# Altium project robocart_steerbrake_node.PrjPcb
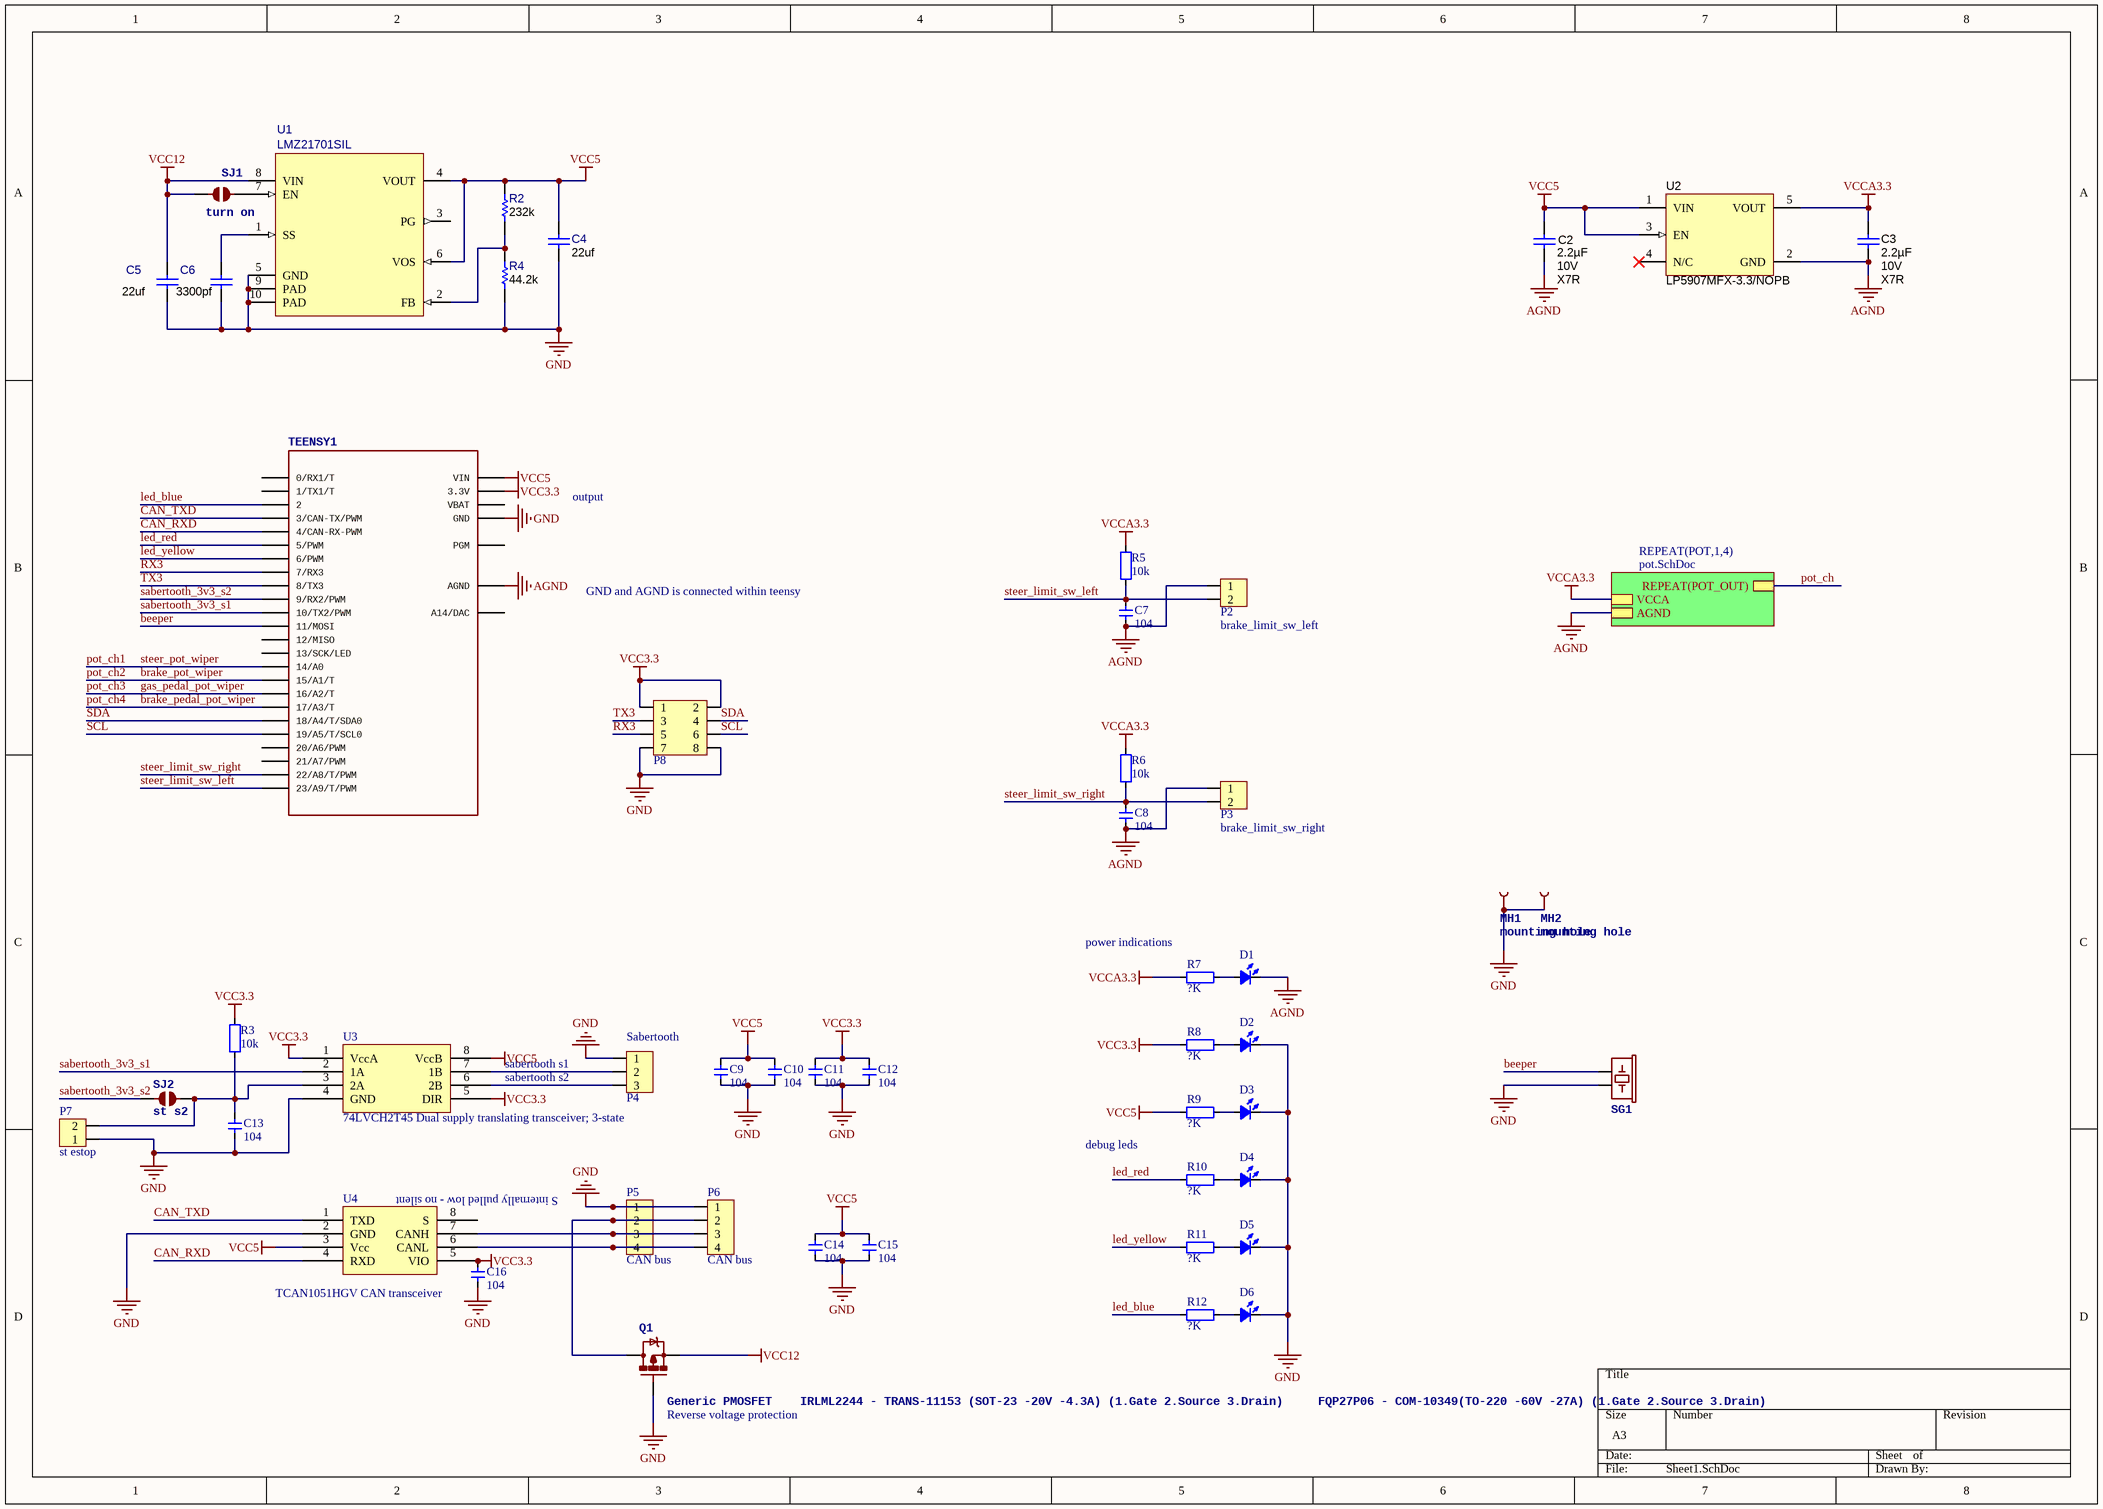
[diagram p0: Sheet1.SchDoc]
2 sheets, 62 parts. Net scope: hierarchical (ports join the sheet entries above them; power ports are global).
Board file: board.PcbDoc
Sheets:
  Sheet1.SchDoc
    POT1 = pot.SchDoc
    POT2 = pot.SchDoc
    POT3 = pot.SchDoc
    POT4 = pot.SchDoc

## Sheet Sheet1.SchDoc
size A3

### Parts
C2  ValueDisplayed: 2.2µF  Value2: 10V  TempCo: X7R  [CAP_0603]  (hidden comment: GRM188R71A225KE15D)
C3  ValueDisplayed: 2.2µF  Value2: 10V  TempCo: X7R  [CAP_0603]  (hidden comment: GRM188R71A225KE15D)
C4  ValueDisplayed: 22uf  [CAP_0805]  (hidden comment: GRM188R71A225KE15D)
C5  ValueDisplayed: 22uf  [CAP_0805]  (hidden comment: GRM155R71E822KA01D)
C6  ValueDisplayed: 3300pf  [CAP_0603]  (hidden comment: GRM155R71E822KA01D)
C7  value 104  [CAP_0603]  (hidden comment: Cap_0603)
C8  value 104  [CAP_0603]  (hidden comment: Cap_0603)
C9  value 104  [CAP_0603]  (hidden comment: Cap_0603)
C10  value 104  [CAP_0603]  (hidden comment: Cap_0603)
C11  value 104  [CAP_0603]  (hidden comment: Cap_0603)
C12  value 104  [CAP_0603]  (hidden comment: Cap_0603)
C13  value 104  [CAP_0603]  (hidden comment: Cap_0603)
C14  value 104  [CAP_0603]  (hidden comment: Cap_0603)
C15  value 104  [CAP_0603]  (hidden comment: Cap_0603)
C16  value 104  [CAP_0603]  (hidden comment: Cap_0603)
D1  LED_0603  [LED_0603_RED]  (value not drawn)
D2  LED_0603  [LED_0603_RED]  (value not drawn)
D3  LED_0603  [LED_0603_RED]  (value not drawn)
D4  LED_0603  [LED_0603_RED]  (value not drawn)
D5  LED_0603  [LED_0603_RED]  (value not drawn)
D6  LED_0603  [LED_0603_RED]  (value not drawn)
MH1  mounting hole  [M3 hole]
MH2  mounting hole  [M3 hole]
P2  brake_limit_sw_left  [COMBICON PTSA 2]
P3  brake_limit_sw_right  [COMBICON PTSA 2]
P4  Sabertooth  [COMBICON PTSA 3]
P5  CAN bus  [COMBICON PTSA 4]
P6  CAN bus  [COMBICON PTSA 4]
P7  st estop  [COMBICON PTSA 2]
P8  HDR2x4_2.54  [HDR2X4_2.54_90]  (value not drawn)
Q1  Generic PMOSFET    IRLML2244 - TRANS-11153 (SOT-23 -20V -4.3A) (1.Gate 2.Source 3.Drain)     FQP27P06 - COM-10349(TO-220 -60V -27A) (1.Gate 2.Source 3.Drain)  [SOT23-3]
R2  value 232k  [RES_0603]  (hidden comment: CRCW040235K7FKED)
R3  value 10k  [RES_0603]  (hidden comment: Res_0603)
R4  value 44.2k  [RES_0603]  (hidden comment: CRCW04026K81FKED)
R5  value 10k  [RES_0603]  (hidden comment: Res_0603)
R6  value 10k  [RES_0603]  (hidden comment: Res_0603)
R7  value ?K  [RES_0603]  (hidden comment: Res_0603)
R8  value ?K  [RES_0603]  (hidden comment: Res_0603)
R9  value ?K  [RES_0603]  (hidden comment: Res_0603)
R10  value ?K  [RES_0603]  (hidden comment: Res_0603)
R11  value ?K  [RES_0603]  (hidden comment: Res_0603)
R12  value ?K  [RES_0603]  (hidden comment: Res_0603)
SG1  Buzzer 12mmSpark Fun Electronics SKU : Comp-Buzzer  [Buzzer_5x5]  (value not drawn)
SJ1  turn on  [HDR1X2_2.54_180]
SJ2  st s2  [PAD-JUMPER-2-NO_YES_SILK]
TEENSY1  Footprint for Teensy 3.1 board using all pin connections on the outer perimeter  [TEENSY_3.1_BASIC_FIXED]  (value not drawn)
U1  LMZ21701SIL  [LMZ21701SIL]
U2  LP5907MFX-3.3/NOPB  [DBV0005A_N]
U3  74LVCH2T45 Dual supply translating transceiver; 3-state  [SOP65P490X110-8N]
U4  TCAN1051HGV CAN transceiver  [SOIC_E200_8]

### Sub-sheets
REPEAT(POT,1,4) = pot.SchDoc: REPEAT(POT_OUT), AGND, VCCA

### Nets
AGND: C2.1 C3.1 C7.1 C8.1 D1.2(K) P2.1 P3.1 TEENSY1.AGND U2.2(GND) ; sheet REPEAT(POT,1,4)/AGND
GND: C4.2 C5.2 C6.2 C9.1 C10.1 C11.1 C12.1 C13.1 C14.1 C15.1 C16.1 D2.2(K) D3.2(K) D4.2(K) D5.2(K) D6.2(K) MH1.P$1 MH2.P$1 P4.1 P5.1 P6.1 P7.1 P8.7 P8.8 Q1.1(G) R4.1 SG1.- TEENSY1.GND_GND1(GND) U1.5(GND) U1.9(PAD) U1.10(PAD) U3.4(GND) U4.2(GND)
VCC3.3: C11.2 C12.2 C16.2 P8.1 P8.2 R3.2 R8.1 TEENSY1.3.3V_3.3V1(3.3V) U3.1(VccA) U3.5(DIR) U4.5(VIO)
VCC5: C2.2 C4.1 C9.2 C10.2 C14.2 C15.2 R2.2 R9.1 TEENSY1.VIN U1.4(VOUT) U1.6(VOS) U2.1(VIN) U2.3(EN) U3.8(VccB) U4.3(Vcc)
VCC12: C5.1 Q1.2(S) SJ1.1 U1.8(VIN)
VCCA3.3: C3.2 R5.2 R6.2 R7.1 U2.5(VOUT) ; sheet REPEAT(POT,1,4)/VCCA
beeper: SG1.+ TEENSY1.11(11/MOSI)
brake_pedal_pot_wiper: TEENSY1.17/A3(17/A3/T)  [also labelled pot_ch4]
brake_pot_wiper: TEENSY1.15/A1(15/A1/T)  [also labelled pot_ch2]
CAN_RXD: TEENSY1.4(4/CAN-RX-PWM) U4.4(RXD)
CAN_TXD: TEENSY1.3(3/CAN-TX/PWM) U4.1(TXD)
gas_pedal_pot_wiper: TEENSY1.16/A2(16/A2/T)  [also labelled pot_ch3]
led_blue: R12.1 TEENSY1.2
led_red: R10.1 TEENSY1.5(5/PWM)
led_yellow: R11.1 TEENSY1.6(6/PWM)
pot_ch: sheet REPEAT(POT,1,4)/REPEAT(POT_OUT)
pot_ch1: TEENSY1.14/A0  [also labelled steer_pot_wiper]
RX3: P8.5 TEENSY1.7(7/RX3)
sabertooth_3v3_s1: TEENSY1.10(10/TX2/PWM) U3.2(1A)
sabertooth_3v3_s2: SJ2.1 TEENSY1.9(9/RX2/PWM)
SCL: P8.6 TEENSY1.19/A5(19/A5/T/SCL0)
SDA: P8.4 TEENSY1.18/A4(18/A4/T/SDA0)
steer_limit_sw_left: C7.2 P2.2 R5.1 TEENSY1.23/A9(23/A9/T/PWM)
steer_limit_sw_right: C8.2 P3.2 R6.1 TEENSY1.22/A8(22/A8/T/PWM)
TX3: P8.3 TEENSY1.8(8/TX3)
NetC6_1: C6.1 U1.1(SS)
NetC13_2: C13.2 P7.2 R3.1 SJ2.2 U3.3(2A)
NetD1_1: D1.1(A) R7.2
NetD2_1: D2.1(A) R8.2
NetD3_1: D3.1(A) R9.2
NetD4_1: D4.1(A) R10.2
NetD5_1: D5.1(A) R11.2
NetD6_1: D6.1(A) R12.2
NetP4_2: P4.2 U3.7(1B)
NetP4_3: P4.3 U3.6(2B)
NetP5_2: P5.2 P6.2 Q1.3(D)
NetP5_3: P5.3 P6.3 U4.7(CANH)
NetP5_4: P5.4 P6.4 U4.6(CANL)
NetR2_1: R2.1 R4.2 U1.2(FB)
NetSJ1_2: SJ1.2 U1.7(EN)

Not connected (* = marked no-connect by the designer): TEENSY1 0(0/RX1/T) 1(1/TX1/T) 12(12/MISO) 13(13/SCK/LED) 20/A6(20/A6/PWM) 21/A7(21/A7/PWM) A14(A14/DAC) PGM VBAT; U1 3(PG); U2 4(N/C)*; U4 8(S)

### Notes on the sheet
- output
- GND and AGND is connected within teensy
- (near R7) power indications
- sabertooth s1
- sabertooth s2
- (near U4) S internally pulled low - no silent
- debug leds
- (near Q1) Reverse voltage protection

### Library data of the parts
C2 C4 = GRM188R71A225KE15D: CAP, CERM, 2.2uF, 10V, +/-10%, X7R, 0603; Manufacturer: MuRata; Polarized: N; CompType: Capacitor; U/M: EA; Cap_F: 0.0000022; Tolerance_%: 10; ESR_Ohm: 0.009; Value1: 0.009 ohm; TaMin_C: -55; TaMax_C: 125; Cap_Case: 0603; SymbolVersion: 2008-07-09; Value: 2.2uF; PartNumber: GRM188R71A225KE15D; PackageReference: 0603; RoHS: Y; VDC_V: 10; MountType: SMT; Technology: Ceramic; Published: 2008-06-19; Publisher: Texas Instruments; ComponentLink1Description: Datasheet link; ComponentLink1URL: http://search.murata.co.jp/Ceramy/PnsearchViewAction.do?HnOFG=ON&HnNFG=ON&SEL_CNT=50&sLang=en&sKey=GRM188R71A225KE15D&x=9&y=9&search=startwith; Supplier 1: Digi-Key; Supplier Part Number 1: 490-4520-1-ND; Supplier 2: Mouser; Supplier Part Number 2: 81-GRM188R71A225KE15; Supplier 3: Farnell; Supplier Part Number 3: 1797012
  C2: LatestRevisionDate: 2014-07-08
  C4: Value2: 10V; TempCo: X7R; LatestRevisionDate: 2014-06-17
C3 = GRM188R71A225KE15D: CAP, CERM, 2.2 µF, 10 V, +/- 10%, X7R, 0603; Manufacturer: MuRata; Polarized: N; CompType: Capacitor; Value: 2.2uF; U/M: EA; Cap_F: 0.0000022; Tolerance_%: 10; ESR_ohm: 0.009; Value1: 0.009 ohm; TaMin_C: -55; TaMax_C: 125; Cap_Case: 0603; SymbolVersion: 2008-07-09; PartNumber: GRM188R71A225KE15D; PackageReference: 0603; RoHS: Y; VDC_V: 10; MountType: SMT; Technology: Ceramic; Published: 2008-06-19; Publisher: Texas Instruments; LatestRevisionDate: 2014-07-21; ComponentLink1Description: Datasheet link; ComponentLink1URL: http://search.murata.co.jp/Ceramy/PnsearchViewAction.do?HnOFG=ON&HnNFG=ON&SEL_CNT=50&sLang=en&sKey=GRM188R71A225KE15D&x=9&y=9&search=startwith; Supplier 1: Digi-Key; Supplier Part Number 1: 490-4520-1-ND; Supplier 2: Mouser; Supplier Part Number 2: 81-GRM188R71A225KE15; Supplier 3: Farnell; Supplier Part Number 3: 1797012
C5 C6 = GRM155R71E822KA01D: CAP, CERM, 8200pF, 25V, +/-10%, X7R, 0402; Manufacturer: MuRata; Polarized: N; CompType: Capacitor; U/M: EA; Cap_F: 0.0000000082; Tolerance_%: 10; Value1: Unknown; VDC_V: 25; TaMin_C: -55; TaMax_C: 125; Cap_Case: 0402; SymbolVersion: 2008-07-09; Value: 8200pF; PartNumber: GRM155R71E822KA01D; PackageReference: 0402; RoHS: Y; Value2: 25V; MountType: SMT; Technology: Ceramic; TempCo: X7R; Published: 2008-06-19; Publisher: Texas Instruments; LatestRevisionDate: 2014-07-07; ComponentLink1Description: Datasheet link; ComponentLink1URL: http://search.murata.co.jp/Ceramy/PnsearchViewAction.do?HnOFG=ON&HnNFG=ON&SEL_CNT=50&sLang=en&sKey=GRM155R71E822KA01D&x=9&y=9&search=startwith; Supplier 1: Digi-Key; Supplier Part Number 1: 490-1311-1-ND; Supplier 2: Mouser; Supplier Part Number 2: 81-GRM155R71E822KA1D
C7-C16 = Cap_0603: Capacitor
D1-D6 = LED_0603: LED
MH1 MH2 = TEST-POINT2: pin to pad: P$1>1
P2 P3 P7 = HDR1x2_2.54: Header
P4 = HDR1x3_2.54: Header
P5 P6 = HDR1x4_2.54: Header
P8 = HDR2x4_2.54: Header
Q1 = MOSFET-PCHANNEL: PROD_ID: TRANS-08285
R2 = CRCW040235K7FKED: RES, 35.7k ohm, 1%, 0.063W, 0402; Manufacturer: Vishay-Dale; CompType: Resistor; Res_ohm: 35700; Value_Code: 35k7; Tolerance_%: 1; Power_W: 0.063; VDC_V: 50; TempCo: 100 ppm/C; EIA_Code: E96; U/M: EA; SymbolVersion: 2009-05-29; PartNumber: CRCW040235K7FKED; PackageReference: 0402; RoHS: Y; Value1: 1%; Value2: 0.063W; MountType: SMT; Technology: Thick Film; Published: 2008-06-26; Publisher: Texas Instruments; LatestRevisionDate: 2014-06-26; ComponentLink1Description: Datasheet link; ComponentLink1URL: http://www.vishay.com/docs/20035/dcrcwe3.pdf; Supplier 1: Digi-Key; Supplier Part Number 1: 541-35.7KLCT-ND; Supplier 2: Mouser; Supplier Part Number 2: 71-CRCW0402-35.7K-E3; Supplier 3: Farnell; Supplier Part Number 3: 1151195
R3 R5-R12 = Res_0603: Resistor
R4 = CRCW04026K81FKED: RES, 6.81k ohm, 1%, 0.063W, 0402; Manufacturer: Vishay-Dale; CompType: Resistor; Res_ohm: 6810; Value_Code: 6k81; Tolerance_%: 1; Power_W: 0.063; VDC_V: 50; TempCo: 100 ppm/C; EIA_Code: E96; U/M: EA; SymbolVersion: 2009-05-29; PartNumber: CRCW04026K81FKED; PackageReference: 0402; RoHS: Y; Value1: 1%; Value2: 0.063W; MountType: SMT; Technology: Thick Film; Published: 2008-06-26; Publisher: Texas Instruments; LatestRevisionDate: 2014-06-26; ComponentLink1Description: Datasheet link; ComponentLink1URL: http://www.vishay.com/docs/20035/dcrcwe3.pdf; Supplier 1: Digi-Key; Supplier Part Number 1: 541-6.81KLCT-ND; Supplier 2: Mouser; Supplier Part Number 2: 71-CRCW0402-6.81K-E3; Supplier 3: Farnell; Supplier Part Number 3: 1652819
SG1 = BUZZERPTH: pin to pad: +>P ->N
SJ1 SJ2 = JUMPER-PAD-2-NOROUND
TEENSY1 = TEENSY_3.1_BASIC: pin to pad: 3.3V 3.3V1>3.3V GND GND1>GND
U1 = LMZ21701SIL: 1A SIMPLE SWITCHER Nano Module with 17V Maximum Input Voltage, SIL0008E; Alternate Manufacturer: None; Manufacturer: Texas Instruments; SymbolCreator: a0411947; CompType: IC; U/M: EA; SymbolVersion: 2013-08-23; PartNumber: LMZ21701SIL; PackageReference: SIL0008E; MountType: SMT; ComponentLink1Description: Datasheet Link; ComponentLink1URL: https://sps06.itg.ti.com/sites/KMS/crossdivteams/altium/docs/ComponentDatasheets/LMZ21701_DS_2013_07_10.pdf; RoHS: Y; Publisher: Texas Instruments; LatestRevisionDate: 2014-08-23
U2 = LP5907MFX-3.3/NOPB: ULTRA LOW-NOISE, 250-mA LINEAR REGULATOR FOR RF AND ANALOG CIRCUITS REQUIRES NO BYPASS CAPACITOR, DBV0005A; Manufacturer: Texas Instruments; Alternate Manufacturer: None; CompType: IC; SymbolCreator: a0799628; U/M: EA; PackageReference: DBV0005A; Publisher: Texas Instruments; PartNumber: LP5907MFX-3.3/NOPB; RoHS: Y; ComponentLink1Description: Datasheet Link; ComponentLink1URL: http://www.ti.com/lit/ds/symlink/lp5907.pdf; SymbolVersion: 2014-03-21; MountType: SMT; LatestRevisionDate: 2014-07-28
U3 = 74LVCH2T45
U4 = TCAN1051HGV

## Sheet pot.SchDoc
size A
Used 4 times, as channels POT1, POT2, POT3, POT4. Parts and nets are listed once, with the designators drawn on the sheet.
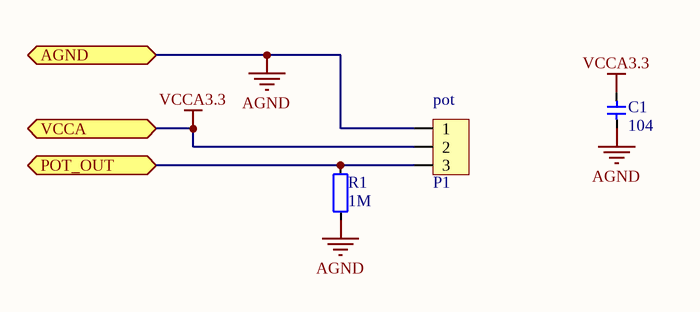
[diagram p1: pot.SchDoc]

### Parts
C1  value 104  [CAP_0603]  (hidden comment: Cap_0603)
P1  pot  [COMBICON PTSA 3]
R1  value 1M  [RES_0603]  (hidden comment: Res_0603)

### Ports
AGND, POT_OUT, VCCA

### Nets
AGND: C1.1 P1.1 R1.1 ; port AGND
VCCA3.3: C1.2 P1.2 ; port VCCA
POT_OUT: P1.3 R1.2 ; port POT_OUT

### Channels
POT1: designators end in _POT1; ports AGND=AGND POT_OUT=pot_ch1 VCCA=VCCA3.3
POT2: designators end in _POT2; ports AGND=AGND POT_OUT=brake_pot_wiper VCCA=VCCA3.3
POT3: designators end in _POT3; ports AGND=AGND POT_OUT=gas_pedal_pot_wiper VCCA=VCCA3.3
POT4: designators end in _POT4; ports AGND=AGND POT_OUT=brake_pedal_pot_wiper VCCA=VCCA3.3

### Library data of the parts
C1 = Cap_0603: Capacitor
P1 = HDR1x3_2.54: Header
R1 = Res_0603: Resistor

## Nets that join several sheets
AGND: Sheet1 (9 pins), POT1 (C1_POT1.1 P1_POT1.1 R1_POT1.1), POT2 (C1_POT2.1 P1_POT2.1 R1_POT2.1), POT3 (C1_POT3.1 P1_POT3.1 R1_POT3.1), POT4 (C1_POT4.1 P1_POT4.1 R1_POT4.1)
VCCA3.3: Sheet1 (5 pins), POT1 (C1_POT1.2 P1_POT1.2), POT2 (C1_POT2.2 P1_POT2.2), POT3 (C1_POT3.2 P1_POT3.2), POT4 (C1_POT4.2 P1_POT4.2)
brake_pedal_pot_wiper: Sheet1 (TEENSY1.17/A3), POT4 (P1_POT4.3 R1_POT4.2)
brake_pot_wiper: Sheet1 (TEENSY1.15/A1), POT2 (P1_POT2.3 R1_POT2.2)
gas_pedal_pot_wiper: Sheet1 (TEENSY1.16/A2), POT3 (P1_POT3.3 R1_POT3.2)
pot_ch1: Sheet1 (TEENSY1.14/A0), POT1 (P1_POT1.3 R1_POT1.2)